# EAGLE design interfaz_1 (EAGLE 6.1)
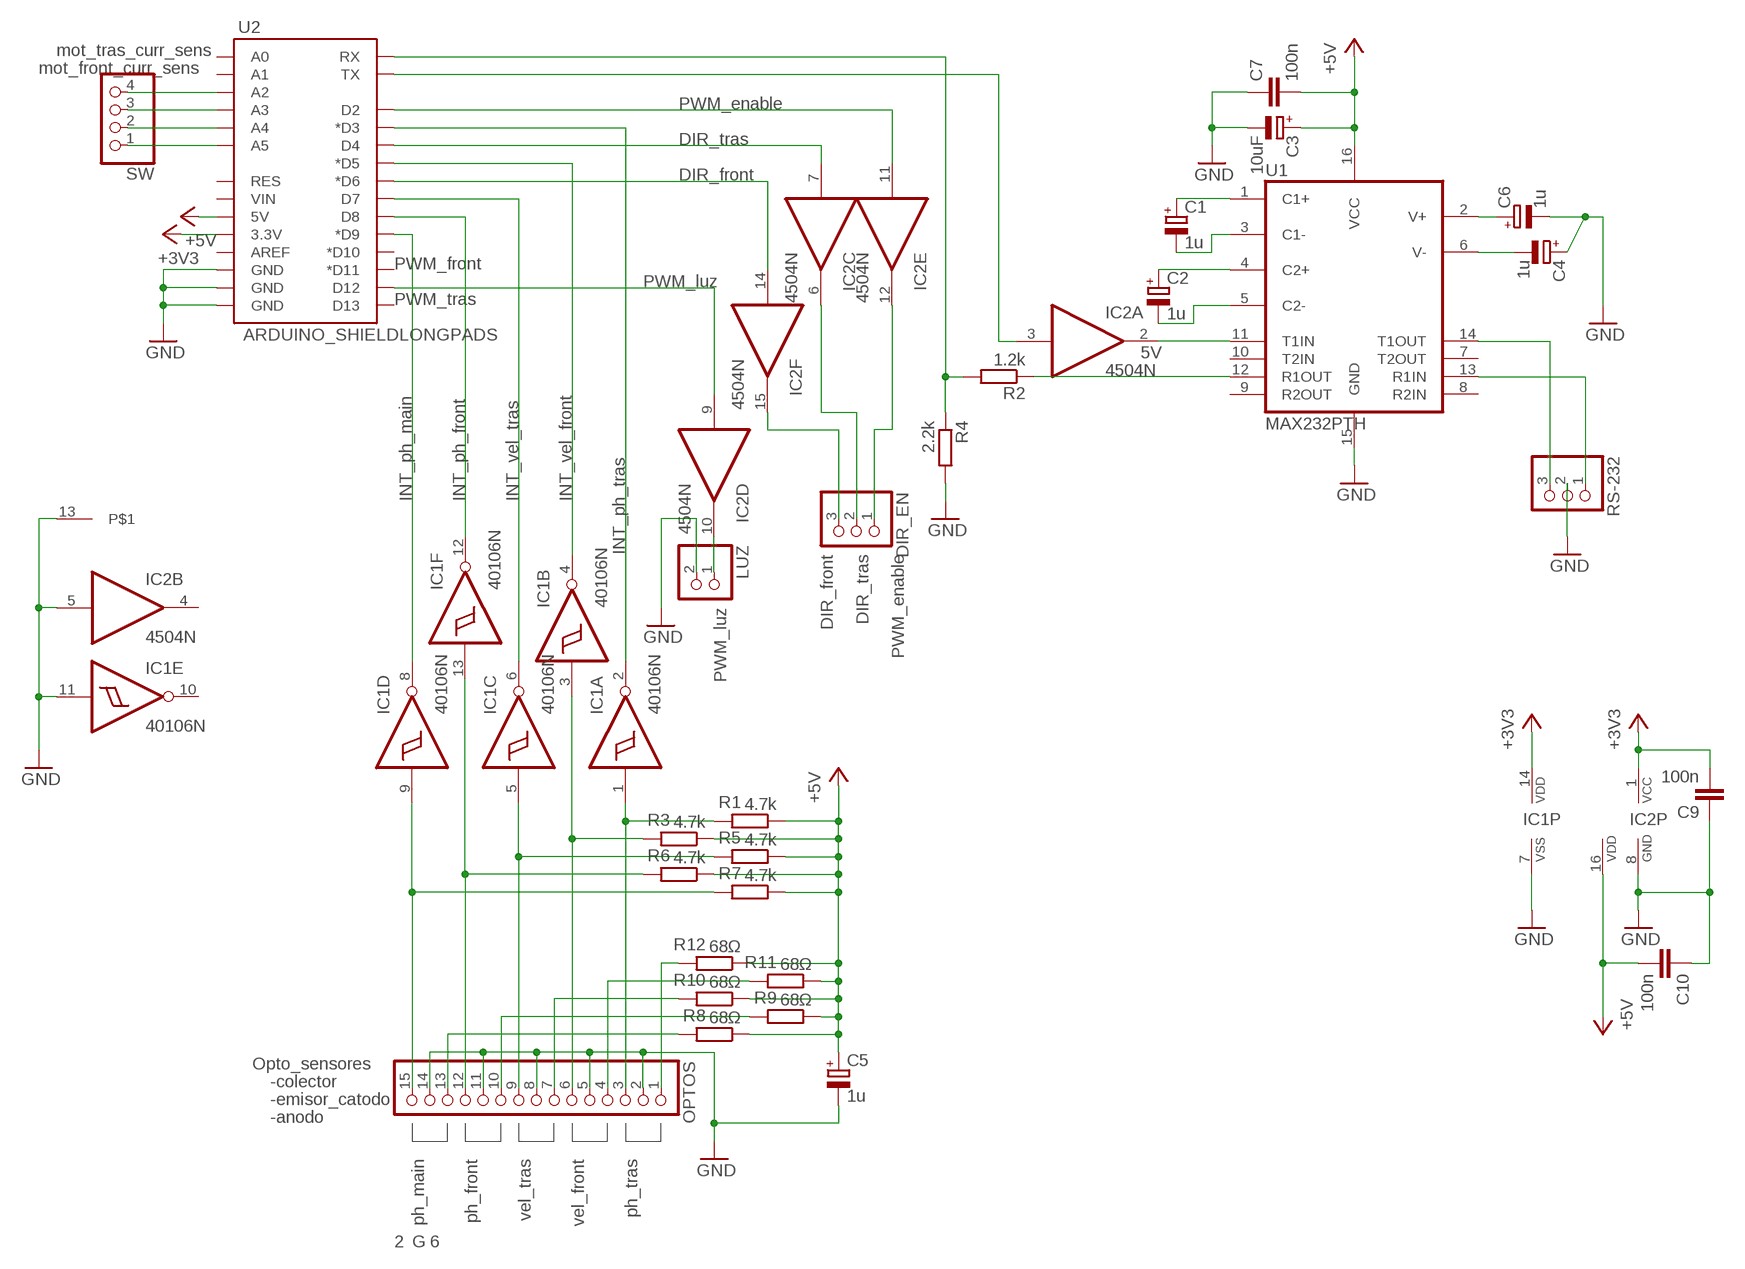
[diagram p0: schematic, sheet 1]

## Parts
C1  1u  CPOL-EUE2-4  [E2-4]
C2  1u  CPOL-EUE2-4  [E2-4]
C3  10uF  CPOL-EUE2-4  [E2-4]
C4  1u  CPOL-EUE2-4  [E2-4]
C5  1u  CPOL-EUE2-4  [E2-4]
C6  1u  CPOL-EUE2-4  [E2-4]
C7  100n  C-EU025-025X050  [C025-025X050]
C9  100n  C-EU025-025X050  [C025-025X050]
C10  100n  C-EU025-025X050  [C025-025X050]
DIR_EN  PINHD-1X3  [1X03]
IC1  40106N  [DIL14]
IC2  4504N  [DIL16]
LUZ  PINHD-1X2  [1X02]
OPTOS  PINHD-1X15  [1X15]
R1  4.7k  R-EU_0204/5  [0204/5]
R2  1.2k  R-EU_0204/5  [0204/5]
R3  4.7k  R-EU_0204/5  [0204/5]
R4  2.2k  R-EU_0204/5  [0204/5]
R5  4.7k  R-EU_0204/5  [0204/5]
R6  4.7k  R-EU_0204/5  [0204/5]
R7  4.7k  R-EU_0204/5  [0204/5]
R8  68Ω  R-EU_0204/5  [0204/5]
R9  68Ω  R-EU_0204/5  [0204/5]
R10  68Ω  R-EU_0204/5  [0204/5]
R11  68Ω  R-EU_0204/5  [0204/5]
R12  68Ω  R-EU_0204/5  [0204/5]
RS-232  PINHD-1X3  [1X03]
SW  PINHD-1X4  [1X04]
U1  MAX232PTH  [DIL16]
U2  ARDUINO_SHIELDLONGPADS  [DUEMILANOVE_SHIELD_LONGPADS]

## Nets
+3V3: C9.2 IC1.14(P:VDD) IC2.1(P:VCC) U2.3.3V
+5V: C3.+ C5.+ C7.2 C10.2 IC2.16(P:VDD) R1.1 R3.1 R5.1 R6.1 R7.1 R8.1 R9.1 R10.1 R11.1 R12.1 U1.16(VCC) U2.5V
GND: C3.- C4.+ C5.- C6.- C7.1 C9.1 C10.1 IC1.7(P:VSS) IC1.11(E:I) IC2.5(B:I) IC2.8(P:GND) IC2.13 LUZ.2 OPTOS.2 OPTOS.5 OPTOS.8 OPTOS.11 OPTOS.14 R4.2 RS-232.2 U1.15(GND) U2.GND@0(GND) U2.GND@1(GND) U2.GND@2(GND)
N$1: C1.+ U1.1(C1+)
N$2: C1.- U1.3(C1-)
N$3: C2.+ U1.4(C2+)
N$4: C2.- U1.5(C2-)
N$5: C4.- U1.6(V-)
N$6: C6.+ U1.2(V+)
N$7: RS-232.1 U1.13(R1IN)
N$8: IC2.11(E:I) U2.D2
N$9: IC2.3(A:I) U2.TX
N$10: R2.1 U1.12(R1OUT)
N$11: R2.2 R4.1 U2.RX
N$12: IC2.2(A:O) U1.11(T1IN)
N$13: DIR_EN.1 IC2.12(E:O)
N$14: RS-232.3 U1.14(T1OUT)
N$15: IC2.7(C:I) U2.D4
N$16: DIR_EN.2 IC2.6(C:O)
N$17: IC2.14(F:I) U2.D6(*D6)
N$18: DIR_EN.3 IC2.15(F:O)
N$19: IC2.9(D:I) U2.D12
N$20: IC2.10(D:O) LUZ.1
N$21: IC1.3(B:I) OPTOS.6 R3.2
N$22: IC1.2(A:O) U2.D3(*D3)
N$23: IC1.4(B:O) U2.D5(*D5)
N$24: IC1.6(C:O) U2.D7
N$25: IC1.12(F:O) U2.D8
N$26: IC1.8(D:O) U2.D9(*D9)
N$27: IC1.1(A:I) OPTOS.3 R1.2
N$28: IC1.5(C:I) OPTOS.9 R5.2
N$29: IC1.13(F:I) OPTOS.12 R6.2
N$30: IC1.9(D:I) OPTOS.15 R7.2
N$31: OPTOS.13 R8.2
N$32: OPTOS.10 R9.2
N$33: OPTOS.7 R10.2
N$34: OPTOS.4 R11.2
N$35: OPTOS.1 R12.2
N$36: SW.1 U2.A5
N$37: SW.2 U2.A4
N$38: SW.3 U2.A3
N$39: SW.4 U2.A2
Unconnected: IC1.10(E:O) IC2.4(B:O) U1.7(T2OUT) U1.8(R2IN) U1.9(R2OUT) U1.10(T2IN) U2.A0 U2.A1 U2.AREF U2.D10(*D10) U2.D11(*D11) U2.D13 U2.RES U2.VIN

## Notes on the sheet
- mot_tras_curr_sens
- mot_front_curr_sens
- PWM_enable
- DIR_tras
- DIR_front
- PWM_front
- PWM_luz
- PWM_tras
- 5V
- INT_ph_main | INT_ph_front | INT_vel_tras | INT_vel_front
- INT_ph_tras | DIR_front | DIR_tras | PWM_enable
- PWM_luz
- Opto_sensores
- -colector
- -emisor_catodo
- -anodo
- ph_main | ph_front | vel_tras | vel_front | ph_tras
- 2 | G | 6

## Library data of the parts
C1-C6 = rcl:CPOL-EU: POLARIZED CAPACITOR, European symbol
C7 C9 C10 = rcl:C-EU: CAPACITOR, European symbol
DIR_EN RS-232 = pinhead:PINHD-1X3: PIN HEADER
IC1 = 40xx:40106: Hex SCHMITT TRIGGER
IC2 = 45xx:4504: TTL or CMOS to CMOS hex LEVEL SHIFTER
LUZ = pinhead:PINHD-1X2: PIN HEADER
OPTOS = pinhead:PINHD-1X15: PIN HEADER
R1-R12 = rcl:R-EU_: RESISTOR, European symbol
SW = pinhead:PINHD-1X4: PIN HEADER
U1 = SparkFun:MAX232: RS232 Transceiver Very common IC. This is generically called 'MAX232', but works with the 3V equivalent MAX3232 generic ICs. Field tested and mother approved. Spark Fun Electronics SKU : COM-00316 (DIP) and COM-00589 (SMD)
U2 = SparkFun:ARDUINO_SHIELD

## Board
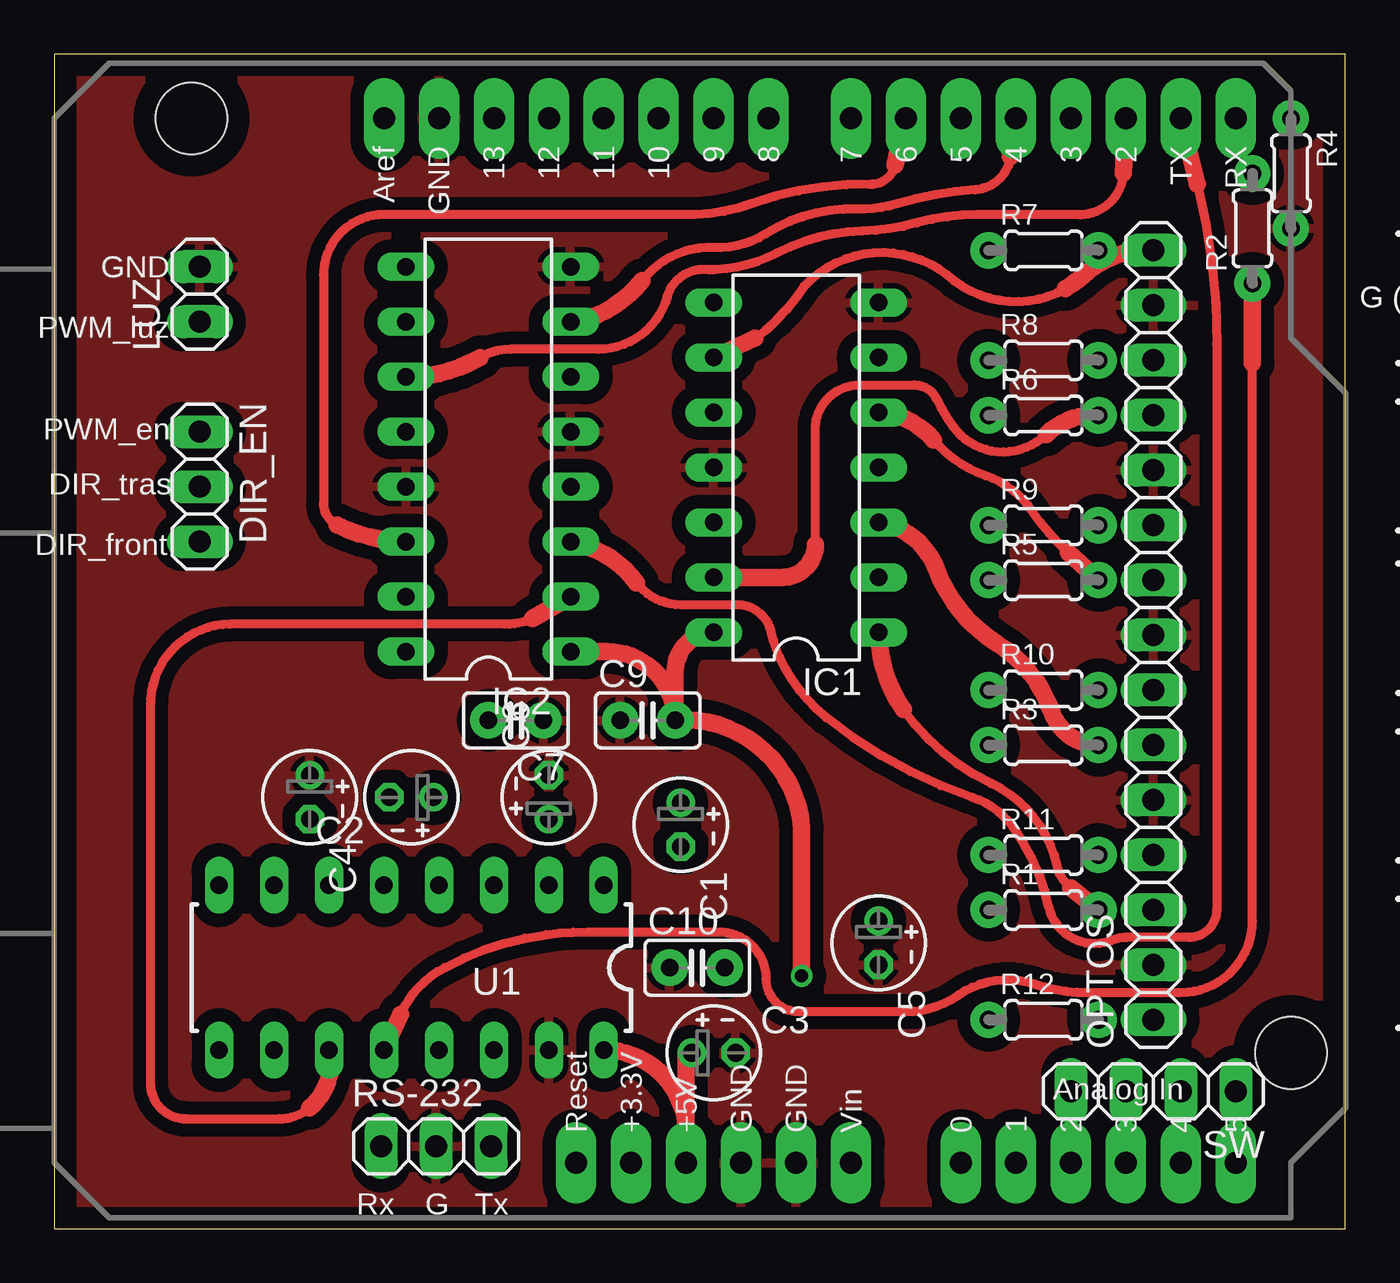
[diagram p1: board, top side]
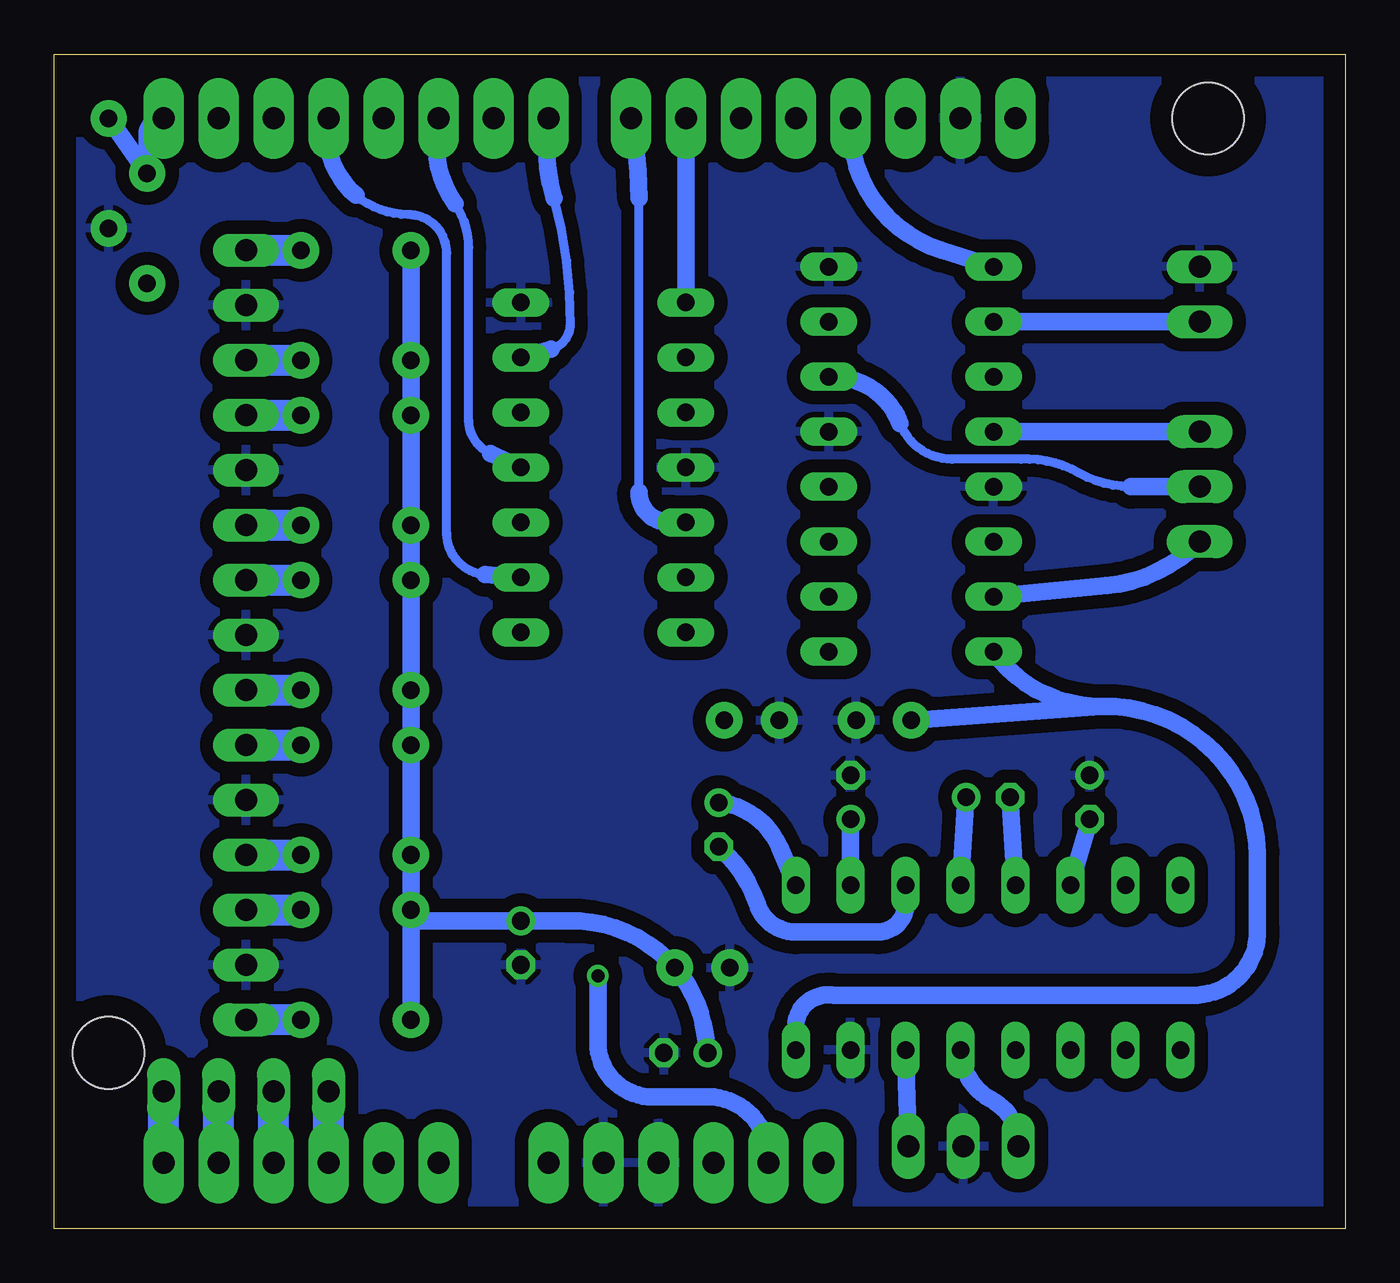
[diagram p2: board, bottom side, seen from below]

Size 59.67 x 54.28 mm. Coordinates in mm from the lower left corner, seen from the top.
Outline: 0,0 59.67,0 59.67,54.28 0,54.28 0,0
Copper layers (1*16): Top 0.035mm / dielectric 1.5mm / Bottom 0.035mm
Design rules: minimum track width 10mil, minimum drill 0.6mm, track to track 8mil, track to pad 8mil, pad to pad 8mil, via to via 8mil, smd to smd 8mil, copper to edge 40mil, drill to drill 8mil, minimum pad ring 10mil, minimum via ring 8mil, stop-mask expansion 4mil, vias tented up to drill 0mil, thermal gap 10mil

### Footprints (pad centres in the part's own frame; a part is rotated, then mirrored left to right if it is on the bottom)
E2-4 = drill 0.813 pad 1.27: + -1.016,0 | drill 0.813 pad 1.27 octagon: - 1.016,0
C025-025X050 = drill 0.813 pad 1.676: 1 -1.27,0; 2 1.27,0
1X03 = drill 1.016 long: 1 -2.54,0; 2 0,0; 3 2.54,0
DIL14 = drill 0.813 long: 1 -7.62,-3.81; 2 -5.08,-3.81; 3 -2.54,-3.81; 4 0,-3.81; 5 2.54,-3.81; 6 5.08,-3.81; 7 7.62,-3.81; 8 7.62,3.81; 9 5.08,3.81; 10 2.54,3.81; 11 0,3.81; 12 -2.54,3.81; 13 -5.08,3.81; 14 -7.62,3.81
DIL16 = drill 0.813 long: 1 -8.89,-3.81; 2 -6.35,-3.81; 3 -3.81,-3.81; 4 -1.27,-3.81; 5 1.27,-3.81; 6 3.81,-3.81; 7 6.35,-3.81; 8 8.89,-3.81; 9 8.89,3.81; 10 6.35,3.81; 11 3.81,3.81; 12 1.27,3.81; 13 -1.27,3.81; 14 -3.81,3.81; 15 -6.35,3.81; 16 -8.89,3.81
1X02 = drill 1.016 long: 1 -1.27,0; 2 1.27,0
1X15 = drill 1.016 long: 1 -17.78,0; 2 -15.24,0; 3 -12.7,0; 4 -10.16,0; 5 -7.62,0; 6 -5.08,0; 7 -2.54,0; 8 0,0; 9 2.54,0; 10 5.08,0; 11 7.62,0; 12 10.16,0; 13 12.7,0; 14 15.24,0; 15 17.78,0
0204/5 = drill 0.813 pad 1.676: 1 -2.54,0; 2 2.54,0
1X04 = drill 1.016 long: 1 -3.81,0; 2 -1.27,0; 3 1.27,0; 4 3.81,0
DUEMILANOVE_SHIELD_LONGPADS = drill 1.016 pad 1.88 long: 3.3V 50.8,26.67; 5V 50.8,29.21; A0 50.8,41.91; A1 50.8,44.45; A2 50.8,46.99; A3 50.8,49.53; A4 50.8,52.07; A5 50.8,54.61; AREF 2.54,15.24; D2 2.54,49.53; D3 2.54,46.99; D4 2.54,44.45; D5 2.54,41.91; D6 2.54,39.37; D7 2.54,36.83; D8 2.54,33.02; D9 2.54,30.48; D10 2.54,27.94; D11 2.54,25.4; D12 2.54,22.86; D13 2.54,20.32; GND@0 50.8,31.75; GND@1 50.8,34.29; GND@2 2.54,17.78; RES 50.8,24.13; RX 2.54,54.61; TX 2.54,52.07; VIN 50.8,36.83 | hole 3.302: 45.72,57.15; 2.54,6.35

### Placement (x,y rotation side)
C1  28.96,18.67 270 top
C2  16.51,19.94 180 top
C3  30.48,8.13 0 top
C4  11.81,19.94 270 top
C5  38.1,13.21 270 top
C6  22.86,19.94 90 top
C7  21.34,23.49 180 top
C9  27.43,23.49 0 top
C10  29.72,12.06 0 top
DIR_EN  6.73,34.29 270 top
IC1  34.29,35.18 90 top
IC2  20.07,35.56 90 top
LUZ  6.73,43.18 90 top
OPTOS  50.8,27.43 90 top
R1  45.72,14.73 0 top
R2  55.37,46.23 90 top
R3  45.72,22.35 0 top
R4  57.15,48.77 270 top
R5  45.72,29.97 0 top
R6  45.72,37.59 0 top
R7  45.72,45.21 0 top
R8  45.72,40.13 0 top
R9  45.72,32.51 0 top
R10  45.72,24.89 0 top
R11  45.72,17.27 0 top
R12  45.72,9.65 0 top
RS-232  17.65,3.81 0 top
SW  50.8,6.35 180 top
U1  16.51,12.06 180 top
U2  0,53.85 270 top

### Tracks (layer width: path | path; a pad name or v marks a point on that pad's centre or on a via)
+3V3  (via drill 0.6)
  Top 0.813: v34.54,11.68 34.54,18.54 arc90 C9.2 | IC2.1 25.53,26.67 arc-90 C9.2 | IC1.14 arc90 28.7,25.78 C9.2
  Bottom 0.813: U2.3.3V 26.67,3.3 arc-90 29.46,6.1 31.75,6.1 arc90 34.54,8.38 v34.54,11.68
+5V
  Top 0.813: U2.5V 29.21,4.44 | 29.21,4.44 arc90 U1.16 | 29.21,4.44 29.21,7.87 arc-90 C3.+
  Bottom 0.813: C3.+ 29.59,9.02 arc-33 C10.2 arc-51 35.94,14.22 C5.+ 42.67,14.22 arc90 R1.1 | R12.1 R1.1 | R1.1 R11.1 R3.1 R10.1 R5.1 R9.1 R6.1 R8.1 R7.1 | U1.16 25.4,9.52 arc90 23.62,10.79 6.86,10.79 arc-90 4.06,13.84 4.06,17.4 arc-90 11.3,24.13 | 11.3,24.13 arc54 IC2.16 | C7.2 11.3,24.13
GND
  pour Bottom (isolate 0.61): -0.51,55.63 61.72,55.63 61.72,-2.03 -0.51,-2.03
  pour Top (isolate 0.61): -1.52,55.63 61.47,55.63 61.47,-1.78 -1.52,-1.78
N$1
  Bottom 0.813: U1.1 26.16,17.65 arc-62 C1.+
N$2
  Bottom 0.813: U1.3 20.32,14.99 arc90 21.59,13.72 25.4,13.72 arc71 27.18,14.99 arc-30 C1.-
N$3
  Bottom 0.813: U1.4 C2.+
N$4
  Bottom 0.813: U1.5 C2.-
N$5
  Bottom 0.813: U1.6 C4.-
N$6
  Bottom 0.813: U1.2 C6.+
N$7
  Bottom 0.813: RS-232.1 15.24,4.7 arc-41 16.38,5.97 arc59 U1.13
N$8
  Top 0.406: 49.4,48.77 arc-91 47.24,46.86 42.67,46.86 arc16 39.88,46.48 arc-14 37.34,46.1 arc26 33.4,45.08 arc-24 30.61,44.32 arc-6 30.1,44.32 arc77 28.32,43.05 arc-74 25.15,40.64 21.08,40.64 arc31 19.68,40.26
  Top 0.813: U2.D2 49.4,48.77 | 19.68,40.26 arc-32 IC2.11
N$9
  Top 0.406: 52.83,48.26 arc-14 53.72,40.89 53.72,14.73 arc-90 52.45,13.46 49.53,13.46 arc23 48.9,13.33 arc-100 45.97,14.86 arc24 44.32,18.54 arc35 42.42,19.94 arc-20 35.69,23.62 arc-27 33.53,26.42 arc-12 33.15,27.56 arc80 31.5,28.83 28.96,28.83 arc-53 26.92,29.84
  Top 0.813: U2.TX 52.83,48.26 | 26.92,29.84 arc42 IC2.3
N$10
  Top 0.406: 16,9.91 arc-37 18.03,12.06 arc-21 22.73,13.59 arc-8 24.64,13.72 30.73,13.72 arc-90 32.89,11.56 arc90 34.42,10.03 39.37,10.03 arc35 41.78,10.79 arc-54 45.34,11.3 arc20 47.75,10.92 52.07,10.92 arc90 55.37,14.22 55.37,40
  Top 0.813: U1.12 16,9.91 | 55.37,40 R2.1
N$11
  Bottom 0.813: U2.RX arc-90 55.37,50.55 R2.2 R4.1
N$12
  Top 0.406: 22.1,28.19 arc-26 20.83,27.94 8.13,27.94 arc90 4.45,24.13 4.45,6.73 arc90 6.1,5.08 10.41,5.08 arc40 11.81,5.59
  Top 0.813: IC2.2 22.1,28.19 | 11.81,5.59 arc63 U1.11
N$13
  Bottom 0.813: DIR_EN.1 IC2.12
N$14
  Bottom 0.813: RS-232.3 U1.14
N$15
  Top 0.406: 44.2,49.53 arc-78 42.55,48.01 arc13 38.99,47.37 arc-18 37.08,47.12 arc34 32.89,45.97 arc-35 30.48,45.34 arc55 27.18,43.81
  Top 0.813: U2.D4 44.2,49.53 | 27.18,43.81 arc-44 IC2.7
N$16
  Bottom 0.406: 9.91,34.29 arc29 12.32,34.92 arc-32 14.99,35.56 18.16,35.56 arc69 20.57,37.21
  Bottom 0.813: DIR_EN.2 9.91,34.29 | 20.57,37.21 arc-71 IC2.6
N$17
  Top 0.406: 38.86,49.15 arc-78 37.72,48.26 arc21 32.26,47.37 arc-22 28.96,46.86 15.24,46.86 arc90 12.45,44.07 12.45,33.53 arc64 13.08,32.51
  Top 0.813: U2.D6 38.86,49.15 | 13.08,32.51 arc25 IC2.14
N$18
  Bottom 0.813: IC2.15 11.05,29.72 arc-39 DIR_EN.3
N$19
  Bottom 0.813: IC2.9 18.67,45.21 arc76 U2.D12
N$20
  Bottom 0.813: LUZ.1 IC2.10
N$21
  Top 0.813: R3.2 arc-70 46.1,23.88 arc38 43.56,27.05 arc-37 40.77,30.48 arc61 IC1.3
  Bottom 1.422: OPTOS.6 R3.2
N$22
  Bottom 0.406: 39.75,30.23 arc85 41.53,32.13 41.53,45.08 arc-90 43.31,46.86 arc40 45.72,47.75
  Bottom 0.813: IC1.2 39.75,30.23 | 45.72,47.75 arc60 U2.D3
N$23
  Bottom 0.406: 39.5,35.81 arc64 40.51,37.34 40.51,45.34 arc-35 41.15,47.37
  Bottom 0.813: IC1.4 39.5,35.81 | 41.15,47.37 arc48 U2.D5
N$24
  Bottom 0.406: 36.7,40.64 arc-74 35.81,41.78 arc-17 36.58,47.62
  Bottom 0.813: IC1.6 36.7,40.64 | 36.58,47.62 arc24 U2.D7
N$25
  Bottom 0.406: 32.64,34.04 32.64,47.62
  Bottom 0.813: IC1.12 31.24,32.64 arc90 32.64,34.04 | 32.64,47.62 arc-12 U2.D8
N$26
  Bottom 0.813: U2.D9 IC1.8
N$27
  Top 0.406: 46.99,15.75 arc-39 46.35,16.76 arc52 43.31,20.57 arc-30 39.24,24
  Top 0.813: R1.2 46.99,15.75 | 39.24,24 arc-34 IC1.1
  Bottom 1.422: OPTOS.3 R1.2
N$28
  Top 0.406: 46.86,31.24 arc-14 45.21,33.15 arc37 43.05,34.8 arc-31 40.64,36.45
  Top 0.813: R5.2 46.86,31.24 | 40.64,36.45 arc47 IC1.5
  Bottom 1.422: OPTOS.9 R5.2
N$29
  Top 0.406: 35.18,31.62 35.18,36.96 arc-90 37.21,38.99 39.75,38.99 arc-64 40.77,38.35 arc10 41.53,37.08 arc98 45.85,36.7
  Top 0.813: IC1.13 33.66,30.1 arc90 35.18,31.62 | 45.85,36.7 arc-48 R6.2
  Bottom 1.422: OPTOS.12 R6.2
N$30
  Top 0.406: 32.38,41.15 arc22 34.67,43.56 arc-85 41.27,44.07 arc71 46.74,43.43
  Top 0.813: IC1.9 32.38,41.15 | 46.74,43.43 arc9 47.75,44.2 arc-46 OPTOS.15
  Bottom 1.422: OPTOS.15 R7.2
N$31
  Bottom 1.422: OPTOS.13 R8.2
N$32
  Bottom 1.422: OPTOS.10 R9.2
N$33
  Bottom 1.422: OPTOS.7 R10.2
N$34
  Bottom 1.422: OPTOS.4 R11.2
N$35
  Bottom 1.422: R12.2 OPTOS.1
N$36
  Bottom 1.422: U2.A5 SW.1
N$37
  Bottom 1.422: U2.A4 SW.2
N$38
  Bottom 1.422: U2.A3 SW.3
N$39
  Bottom 1.422: U2.A2 SW.4

### Text on the board
tPlace: C | GND | G (k-e) | ph_main | PWM_luz | A | PWM_en | DIR_tras | ph_front | DIR_front | M_tras | M_front | ph_tras | Rx | G | Tx